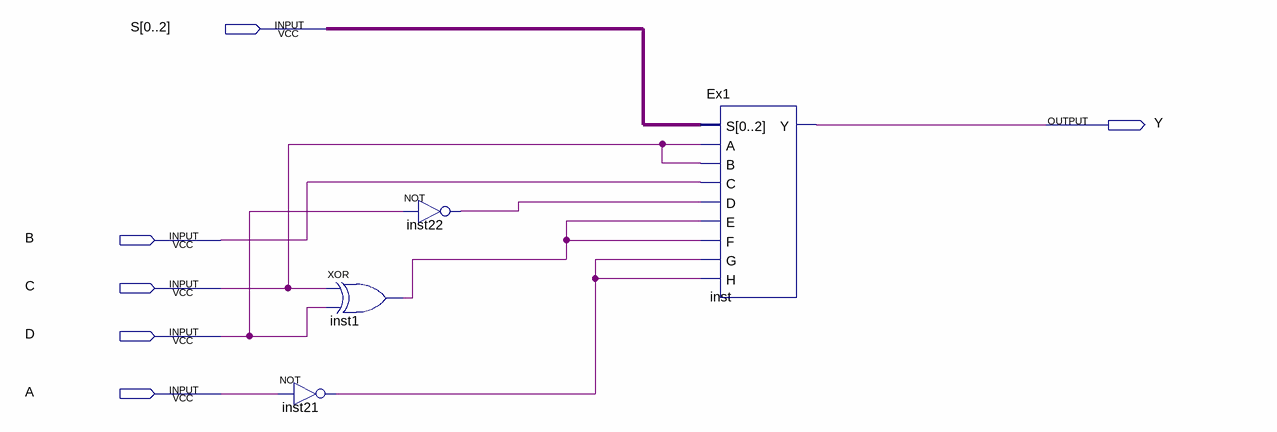
[diagram p0: schematic sheet]
// Quartus schematic Ex2.bdf as structural Verilog: 4 symbols, 6 pins
module Ex2 (
  input  [0:2] S,
  input  B,
  input  C,
  input  D,
  input  A,
  output Y
);

  wire inst1_out, inst21_out, inst22_out;

  not inst21 (inst21_out, A);
  xor inst1 (inst1_out, C, D);
  not inst22 (inst22_out, D);
  Ex1 inst (
    .S(S), .A(C), .B(C), .C(B), .D(inst22_out), .E(inst1_out), .F(inst1_out), .G(inst21_out), .H(inst21_out),
    .Y(Y));
endmodule
